# EAGLE design 8x8matrix (EAGLE 7.1.0)
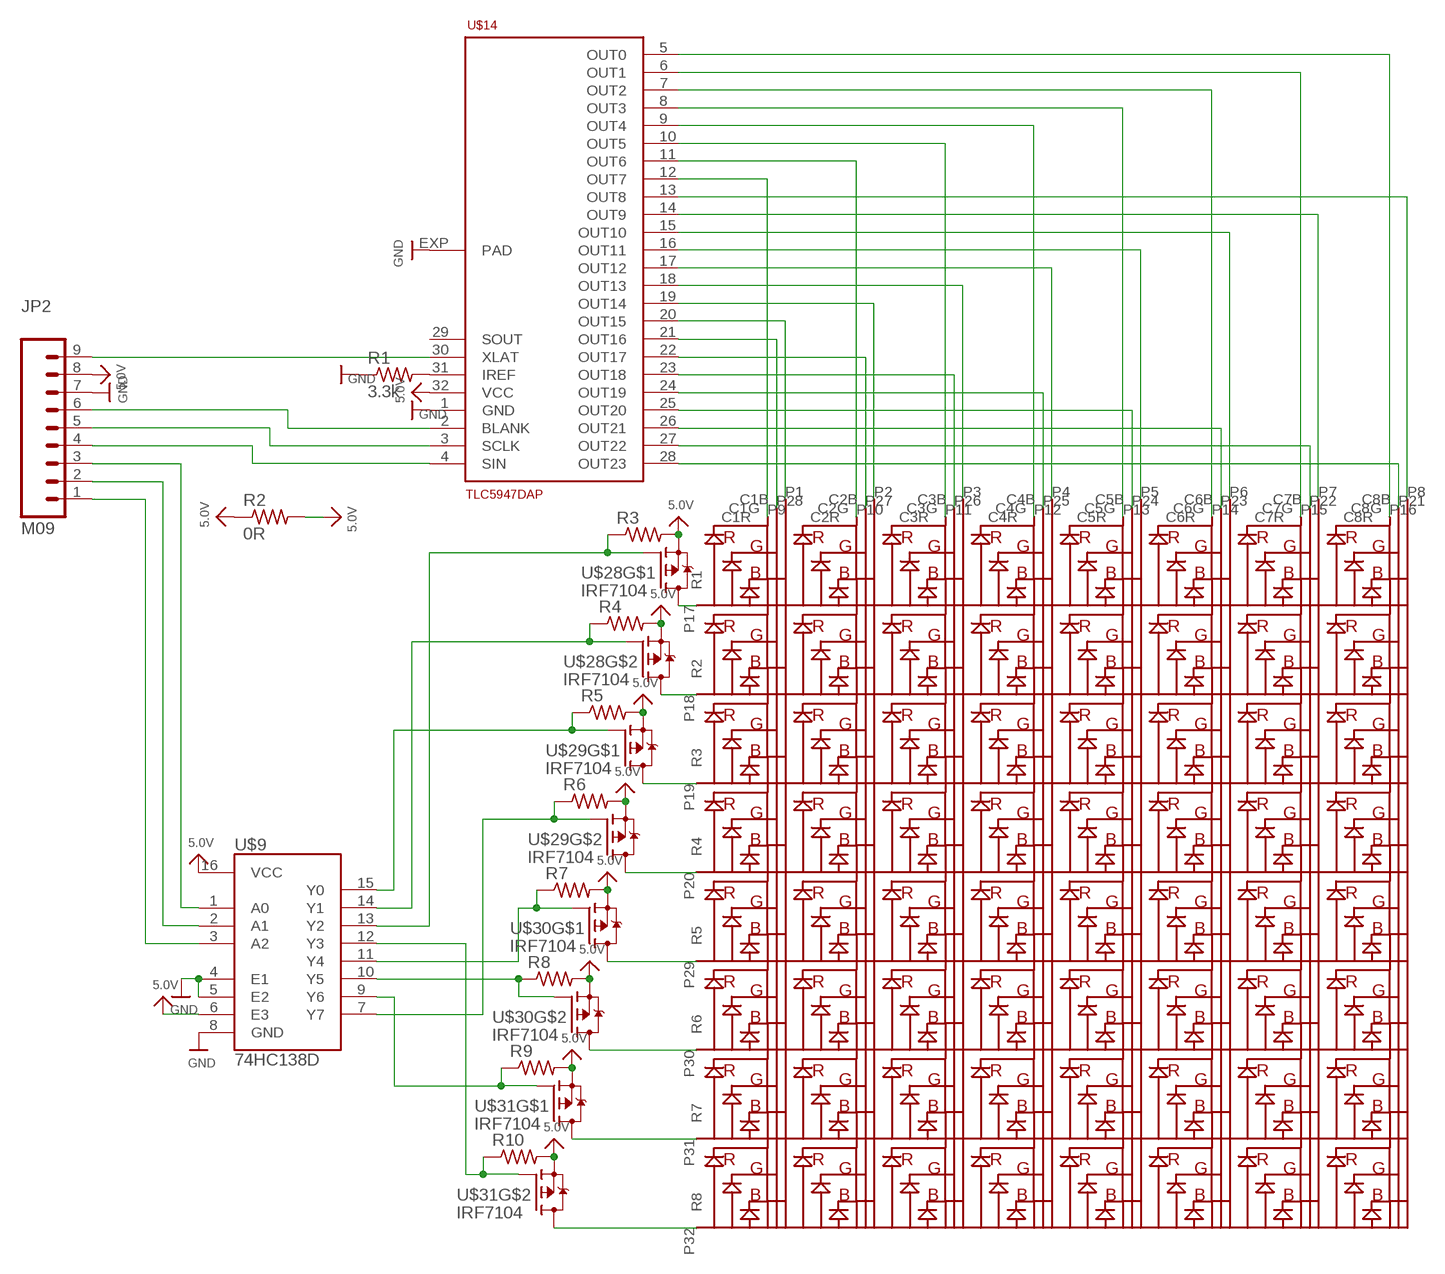
[diagram p0: schematic, sheet 1]

## Parts
JP2  M09  [1X09]
R1  3.3k  R-US_R0805  [R0805]
R2  0R  R-US_M1206  [M1206]
R3  R-US_R0805  [R0805]
R4  R-US_R0805  [R0805]
R5  R-US_R0805  [R0805]
R6  R-US_R0805  [R0805]
R7  R-US_R0805  [R0805]
R8  R-US_R0805  [R0805]
R9  R-US_R0805  [R0805]
R10  R-US_R0805  [R0805]
U$1  GTM2088ARGB  [8X8MATRIX]
U$9  74HC138D  [SO-16]
U$14  TLC5947DAP  [HTSSOP32DAP]
U$28  IRF7104  [SOIC8]
U$29  IRF7104  [SOIC8]
U$30  IRF7104  [SOIC8]
U$31  IRF7104  [SOIC8]

## Nets
5.0V: JP2.8 R2.1 R2.2 R3.2 R4.2 R5.2 R6.2 R7.2 R8.2 R9.2 R10.2 U$9.6(E3) U$9.16(VCC) U$14.32(VCC) U$28.1(S) U$28.3(S) U$29.1(S) U$29.3(S) U$30.1(S) U$30.3(S) U$31.1(S) U$31.3(S)
BLANK: JP2.6 U$14.2(BLANK)
GND: JP2.7 R1.1 U$9.4(E1) U$9.5(E2) U$9.8(GND) U$14.1(GND) U$14.EXP(PAD)
N$1: U$1.P16(C8R) U$14.5(OUT0)
N$2: U$1.P15(C7R) U$14.6(OUT1)
N$3: U$1.P14(C6R) U$14.7(OUT2)
N$4: U$1.P13(C5R) U$14.8(OUT3)
N$5: U$1.P12(C4R) U$14.9(OUT4)
N$6: U$1.P11(C3R) U$14.10(OUT5)
N$7: U$1.P10(C2R) U$14.11(OUT6)
N$8: U$1.P9(C1R) U$14.12(OUT7)
N$9: U$1.P8(C8B) U$14.13(OUT8)
N$10: U$1.P7(C7B) U$14.14(OUT9)
N$11: U$1.P6(C6B) U$14.15(OUT10)
N$12: U$1.P5(C5B) U$14.16(OUT11)
N$13: U$1.P4(C4B) U$14.17(OUT12)
N$14: U$1.P3(C3B) U$14.18(OUT13)
N$15: U$1.P2(C2B) U$14.19(OUT14)
N$16: U$1.P1(C1B) U$14.20(OUT15)
N$17: U$1.P28(C1G) U$14.21(OUT16)
N$18: U$1.P27(C2G) U$14.22(OUT17)
N$19: U$1.P26(C3G) U$14.23(OUT18)
N$20: U$1.P25(C4G) U$14.24(OUT19)
N$21: U$1.P24(C5G) U$14.25(OUT20)
N$22: U$1.P23(C6G) U$14.26(OUT21)
N$23: U$1.P22(C7G) U$14.27(OUT22)
N$24: U$1.P21(C8G) U$14.28(OUT23)
N$27: R1.2 U$14.31(IREF)
N$28: U$1.P19(R3) U$29.7(D) U$29.8(D)
N$32: U$1.P18(R2) U$28.5(D) U$28.6(D)
N$36: JP2.3 U$9.1(A0)
N$37: JP2.2 U$9.2(A1)
N$38: JP2.1 U$9.3(A2)
N$39: U$1.P17(R1) U$28.7(D) U$28.8(D)
N$40: U$1.P29(R5) U$30.7(D) U$30.8(D)
N$41: U$1.P31(R7) U$31.7(D) U$31.8(D)
N$42: U$1.P20(R4) U$29.5(D) U$29.6(D)
N$50: U$1.P30(R6) U$30.5(D) U$30.6(D)
N$52: U$1.P32(R8) U$31.5(D) U$31.6(D)
SCLK: JP2.5 U$14.3(SCLK)
SIN: JP2.4 U$14.4(SIN)
XLAT: JP2.9 U$14.30(XLAT)
Y0: R5.1 U$9.15(Y0) U$29.2(G)
Y1: R4.1 U$9.14(Y1) U$28.4(G)
Y2: R3.1 U$9.13(Y2) U$28.2(G)
Y3: R10.1 U$9.12(Y3) U$31.4(G)
Y4: R7.1 U$9.11(Y4) U$30.2(G)
Y5: R8.1 U$9.10(Y5) U$30.4(G)
Y6: R9.1 U$9.9(Y6) U$31.2(G)
Y7: R6.1 U$9.7(Y7) U$29.4(G)
Unconnected: U$14.29(SOUT)

## Library data of the parts
JP2 = SparkFun-Connectors:M09: Header 9 Standard 9-pin 0.1" header. Use with straight break away headers (SKU : PRT-00116), right angle break away headers (PRT-00553), swiss pins (PRT-00743), machine pins (PRT-00117), and female headers (PRT-00115).
R1-R10 = resistor:R-US_: RESISTOR, American symbol
U$1 = mylib:GTM2088ARGB: a 8x8 RGB matrix
U$9 = mylib:74HC138: M74HC238 - CMOS 3 TO 8 LINE DECODER
U$14 = TLC5947:TLC5947
U$28-U$31 = mylib:IRF7104

## Board
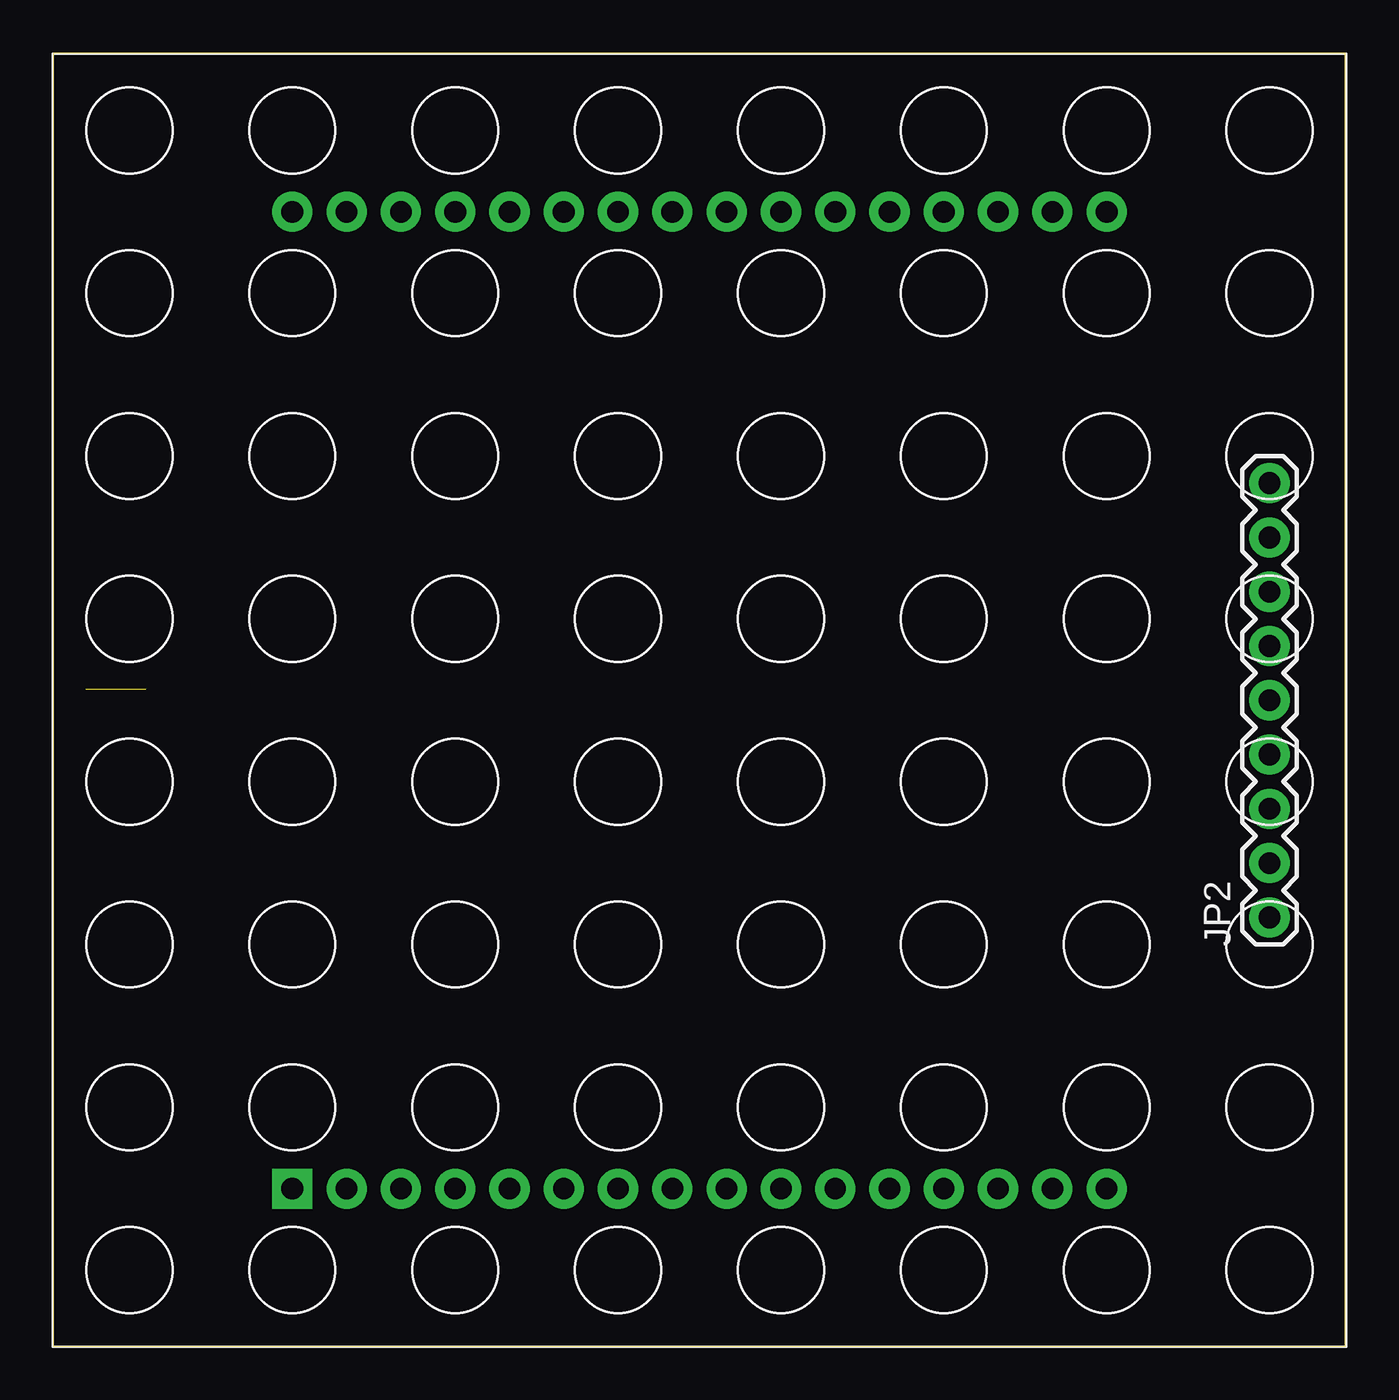
[diagram p1: board, top side]
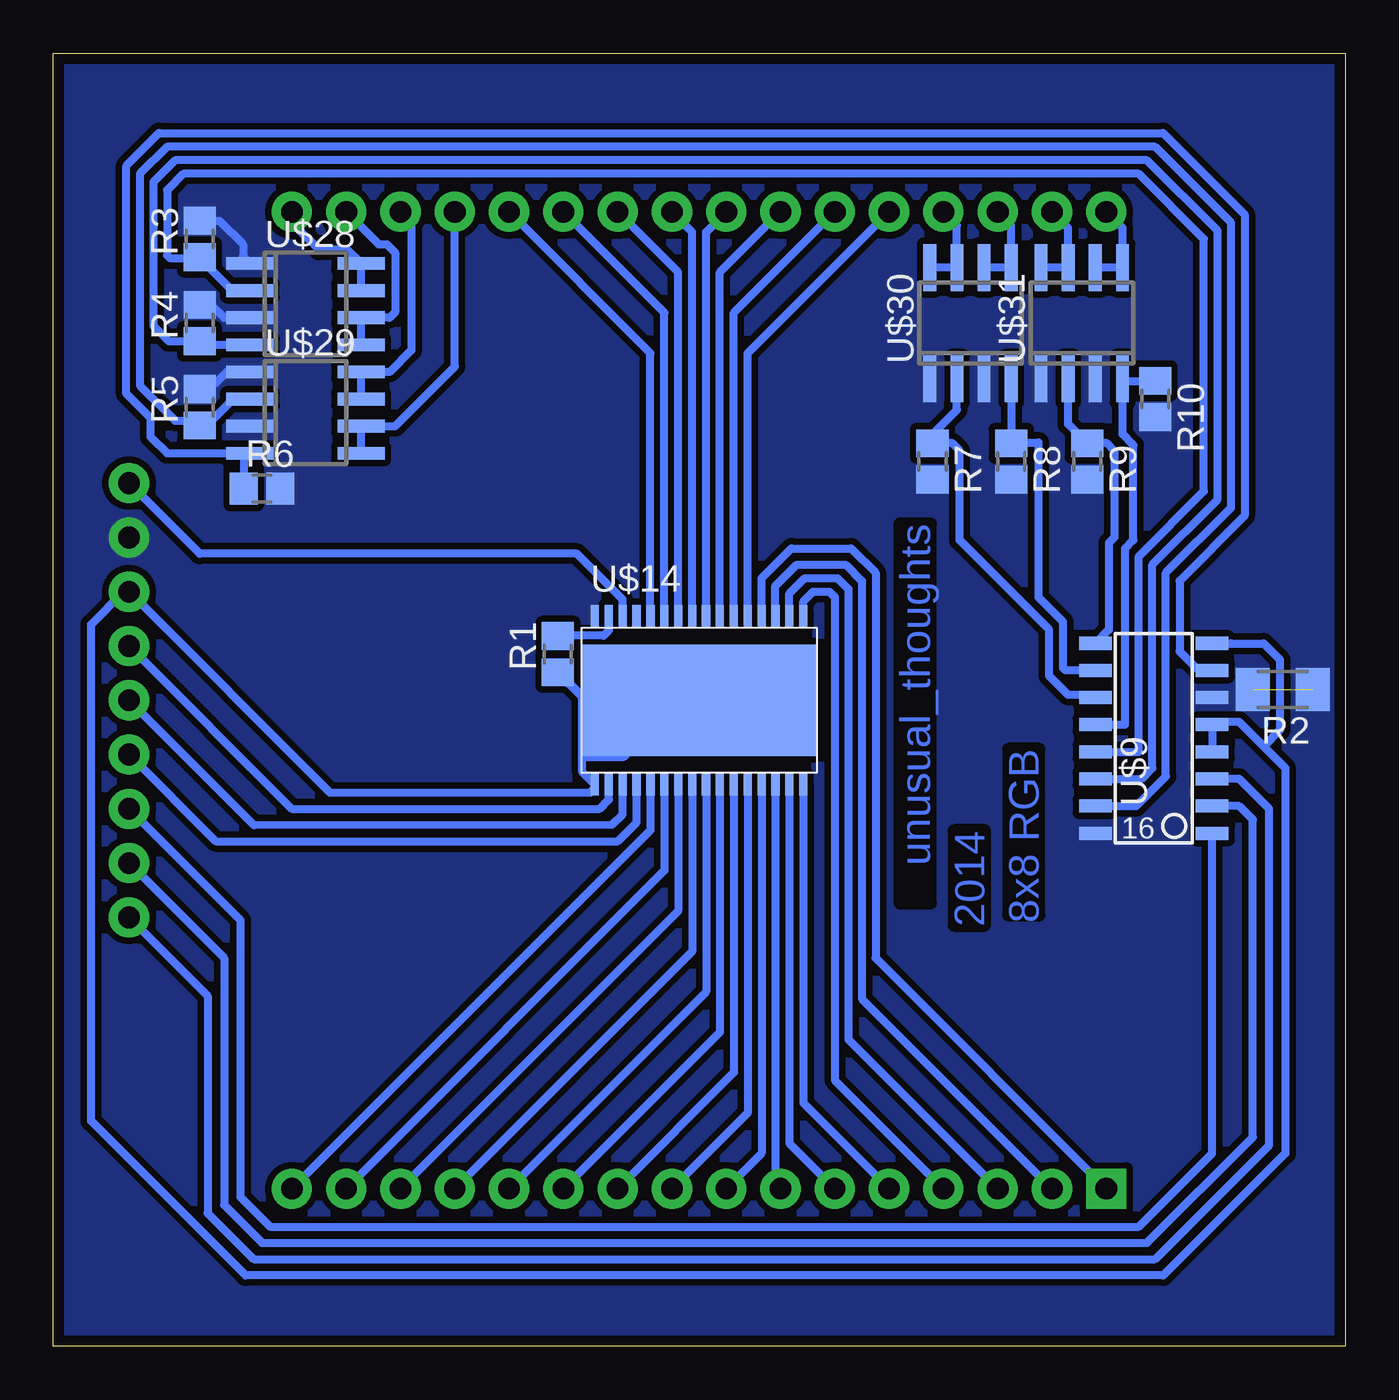
[diagram p2: board, bottom side, seen from below]

Size 60.43 x 60.5 mm. Coordinates in mm from the lower left corner, seen from the top.
Outline: 0,0 60.43,0 60.43,60.5 0,60.5 0,0
Copper layers (1*16): Top 0.035mm / dielectric 1.5mm / Bottom 0.035mm
Design rules "default *": minimum track width 15mil, minimum drill 24mil, track to track 10mil, track to pad 10mil, pad to pad 10mil, via to via 8mil, smd to smd 8mil, copper to edge 20mil, drill to drill 8mil, minimum pad ring 10mil, minimum via ring 8mil, stop-mask expansion 6mil, vias tented up to drill 0mil, thermal gap 10mil

### Footprints (pad centres in the part's own frame; a part is rotated, then mirrored left to right if it is on the bottom)
1X09 = drill 1.016 pad 1.88: 1 0,0; 2 2.54,0; 3 5.08,0; 4 7.62,0; 5 10.16,0; 6 12.7,0; 7 15.24,0; 8 17.78,0; 9 20.32,0
R0805 = smd 1.3 x 1.5: 1 -0.85,0; 2 0.85,0
M1206 = smd 1.6 x 2: 1 -1.4,0; 2 1.4,0
8X8MATRIX = drill 1.016 pad 1.88 square: P1 -19.05,-22.86 | drill 1.016 pad 1.88: P2 -16.51,-22.86; P3 -13.97,-22.86; P17 19.05,22.86; P18 16.51,22.86; P19 13.97,22.86; P20 11.43,22.86; P21 8.89,22.86; P22 6.35,22.86; P23 3.81,22.86; P24 1.27,22.86; P25 -1.27,22.86; P26 -3.81,22.86; P27 -6.35,22.86; P28 -8.89,22.86; P29 -11.43,22.86; P30 -13.97,22.86; P31 -16.51,22.86; P32 -19.05,22.86 | drill 1 pad 1.88: P4 -11.43,-22.86; P5 -8.89,-22.86; P6 -6.35,-22.86; P7 -3.81,-22.86; P8 -1.27,-22.86; P9 1.27,-22.86; P10 3.81,-22.86; P11 6.35,-22.86; P12 8.89,-22.86; P13 11.43,-22.86; P14 13.97,-22.86; P15 16.51,-22.86; P16 19.05,-22.86
SO-16 = smd 0.61 x 1.524: 1 -4.445,-2.794; 2 -3.175,-2.794; 3 -1.905,-2.794; 4 -0.635,-2.794; 5 0.635,-2.794; 6 1.905,-2.794; 7 3.175,-2.794; 8 4.445,-2.794; 9 4.445,2.667; 10 3.175,2.667; 11 1.905,2.667; 12 0.635,2.667; 13 -0.635,2.667; 14 -1.905,2.667; 15 -3.175,2.667; 16 -4.445,2.667
HTSSOP32DAP = smd 0.381 x 1: 1 -4.875,-3.95; 2 -4.225,-3.95; 3 -3.575,-3.95; 4 -2.925,-3.95; 5 -2.275,-3.95; 6 -1.625,-3.95; 7 -0.975,-3.95; 8 -0.325,-3.95; 9 0.325,-3.95; 10 0.975,-3.95; 11 1.625,-3.95; 12 2.275,-3.95; 13 2.925,-3.95; 14 3.575,-3.95; 15 4.225,-3.95; 16 4.875,-3.95; 17 4.875,3.95; 18 4.225,3.95; 19 3.575,3.95; 20 2.925,3.95; 21 2.275,3.95; 22 1.625,3.95; 23 0.975,3.95; 24 0.325,3.95; 25 -0.325,3.95; 26 -0.975,3.95; 27 -1.625,3.95; 28 -2.275,3.95; 29 -2.925,3.95; 30 -3.575,3.95; 31 -4.225,3.95; 32 -4.875,3.95 | smd 11 x 5.2: EXP 0,0
SOIC8 = smd 0.6 x 2.2: 1 -1.905,-2.6; 2 -0.635,-2.6; 3 0.635,-2.6; 4 1.905,-2.6; 5 1.905,2.6; 6 0.635,2.6; 7 -0.635,2.6; 8 -1.905,2.6

### Placement (x,y rotation side)
JP2  56.9,20.07 90 top
R1  36.83,32.38 90 bottom
R2  2.92,30.73 180 bottom
R3  53.59,51.82 90 bottom
R4  53.59,47.88 90 bottom
R5  53.59,43.94 90 bottom
R6  50.67,40.13 0 bottom
R7  19.3,41.4 270 bottom
R8  15.62,41.4 270 bottom
R9  12.06,41.4 270 bottom
R10  8.89,44.32 270 bottom
U$1  30.23,30.23 0 top
U$9  9.02,28.45 90 bottom
U$14  30.23,30.23 0 bottom
U$28  48.64,48.77 270 bottom
U$29  48.64,43.69 270 bottom
U$30  17.53,47.88 0 bottom
U$31  12.32,47.88 0 bottom

### Tracks (layer width: path | path; a pad name or v marks a point on that pad's centre or on a via)
5.0V  (1 unrouted)
  Bottom 0.381: R5.2 52.87,45.05 52.32,45.59 U$29.1 | R4.2 53.05,48.73 52.45,48.13 U$28.3 | R3.2 52.67,52.67 51.56,51.56 51.56,50.99 U$28.1
  pour Bottom (isolate 0.305, no thermals): 0,60.45 0,0 60.45,0 60.45,60.45
BLANK
  Bottom 0.381: U$14.2 34.44,26.22 34.44,25.58 34.87,25.15 49.28,25.15 JP2.6
GND
  Bottom 0.381: U$14.EXP 30.35,30.1 31.24,30.1 33.78,27.56 35.69,27.56 35.69,26.86 U$14.1 35.1,26.11 35.31,25.91 47.5,25.91 JP2.7 57.15,35.31 58.67,33.78 58.67,10.54 51.44,3.3 8.51,3.3 2.79,9.02 2.79,27.05 3.81,28.07 | U$9.4 U$9.5 6.1,29.21 4.95,29.21 3.81,28.07 | 5.33,32.89 U$9.8 3.81,32.89 3.05,32.13 3.05,28.83 3.81,28.07
  Bottom 0.406: 35.69,27.56 35.69,30.39 R1.1
N$1
  Bottom 0.381: U$14.5 32.5,24.14 U$1.P16
N$2
  Bottom 0.381: U$14.6 31.85,22.25 U$1.P15
N$3
  Bottom 0.381: U$14.7 31.2,20.36 U$1.P14
N$4
  Bottom 0.381: U$14.8 30.55,18.47 U$1.P13
N$5
  Bottom 0.381: U$14.9 29.9,16.58 U$1.P12
N$6
  Bottom 0.381: U$14.10 29.25,14.69 U$1.P11
N$7
  Bottom 0.381: U$14.11 28.6,12.8 U$1.P10
N$8
  Bottom 0.381: U$14.12 27.95,10.91 U$1.P9
N$9
  Bottom 0.381: U$14.13 27.3,9.02 U$1.P8
N$10
  Bottom 0.381: U$14.14 26.65,7.6 U$1.P7
N$11
  Bottom 0.381: U$14.15 26,9.49 U$1.P6
N$12
  Bottom 0.381: U$14.16 25.35,11.38 U$1.P5
N$13
  Bottom 0.381: U$14.17 25.35,34.85 24.89,35.31 24.13,35.31 23.88,35.05 23.88,12.45 U$1.P4
N$14
  Bottom 0.381: U$14.18 26,35.21 25.27,35.94 23.75,35.94 23.24,35.43 23.24,14.35 U$1.P3
N$15
  Bottom 0.381: U$14.19 26.65,35.58 25.65,36.58 23.37,36.58 22.61,35.81 22.61,16.26 U$1.P2
N$16
  Bottom 0.381: U$14.20 27.3,35.95 25.91,37.34 23.11,37.34 21.97,36.2 21.97,18.16 U$1.P1
N$17
  Bottom 0.381: U$14.21 27.95,46.47 U$1.P28
N$18
  Bottom 0.381: U$14.22 28.6,48.36 U$1.P27
N$19
  Bottom 0.381: U$14.23 29.25,50.25 U$1.P26
N$20
  Bottom 0.381: U$14.24 29.9,52.14 U$1.P25
N$21
  Bottom 0.381: U$14.25 30.55,52.14 U$1.P24
N$22
  Bottom 0.381: U$14.26 31.2,50.25 U$1.P23
N$23
  Bottom 0.381: U$14.27 31.85,48.36 U$1.P22
N$24
  Bottom 0.381: U$14.28 32.5,46.47 U$1.P21
N$27
  Bottom 0.381: U$14.31 34.45,33.49 34.7,33.25 36.82,33.25 R1.2
N$28
  Bottom 0.381: U$29.7 U$29.8 44.7,45.59 43.69,46.61 43.69,52.58 U$1.P19
N$32
  Bottom 0.381: U$28.5 U$28.6 44.7,48.13 44.45,48.39 44.45,51.18 44.83,51.56 45.21,51.56 U$1.P18
N$36
  Bottom 0.381: JP2.3 51.69,19.94 51.69,6.99 50.29,5.59 9.65,5.59 6.22,9.02 U$9.1
N$37
  Bottom 0.381: JP2.2 52.45,18.16 52.45,6.6 50.67,4.83 9.27,4.83 4.32,9.78 4.32,24.64 4.95,25.27 U$9.2
N$38
  Bottom 0.381: JP2.1 53.21,16.38 53.21,6.22 51.05,4.06 8.89,4.06 3.56,9.4 3.56,25.15 4.95,26.54 U$9.3
N$39
  Bottom 0.381: U$28.7 U$28.8 46.68,51.31 48.01,51.31 49.28,52.58 U$1.P17
N$40
  Bottom 0.381: U$1.P29 18.16,52.45 U$30.7 U$30.8
N$41
  Bottom 0.381: U$1.P31 12.95,52.32 U$31.7 U$31.8
N$42
  Bottom 0.381: U$29.5 U$29.6 45.97,43.12 45.97,43.18 45.85,43.05 44.45,43.05 41.66,45.85 U$1.P20
N$50
  Bottom 0.381: U$1.P30 15.62,52.45 U$30.5 U$30.6
N$52
  Bottom 0.381: U$1.P32 10.41,52.32 U$31.5 U$31.6
SCLK
  Bottom 0.381: U$14.3 33.81,26.26 33.81,24.89 34.29,24.41 51.05,24.38 JP2.5
SIN
  Bottom 0.381: U$14.4 33.15,24.51 34.04,23.62 52.83,23.62 JP2.4
XLAT
  Bottom 0.381: U$14.30 33.8,34.94 35.94,37.08 53.59,37.08 JP2.9
Y0
  Bottom 0.381: U$9.15 9.78,25.27 8.38,26.67 8.38,36.2 5.33,39.24 5.33,52.58 8.89,56.13 55.12,56.13 56.39,54.86 56.39,44.96 54.74,43.31 53.63,43.31 R5.1 53.25,43.38 52.96,43.38 52.02,44.32 U$29.2
Y1
  Bottom 0.381: U$9.14 9.53,26.54 9.02,27.05 9.02,36.58 5.97,39.62 5.97,52.2 9.27,55.5 54.74,55.5 55.75,54.48 55.75,47.75 55.03,47.03 R4.1 53.43,46.86 U$28.4
Y2
  Bottom 0.381: U$9.13 9.65,27.81 9.65,36.96 6.6,40.01 6.6,51.82 9.65,54.86 54.36,54.86 55.12,54.1 55.12,51.05 54.99,50.93 53.59,50.93 | 53.59,50.93 52.07,49.4 U$28.2 | R3.1 53.59,50.93
Y3
  Bottom 0.381: U$9.12 10.29,29.08 10.29,37.34 9.91,37.72 9.91,42.16 10.41,42.67 U$31.4 | 10.29,45.28 U$31.4 | U$31.4 10.31,45.17 R10.1
Y4
  Bottom 0.381: U$9.11 11.81,30.48 12.95,30.48 13.84,31.37 13.84,33.53 18.03,37.72 18.03,41.91 18.38,42.25 R7.1 19.34,42.29 19.68,42.29 18.16,43.81 U$30.2
Y5
  Bottom 0.381: U$9.10 13.08,31.62 13.21,31.75 13.21,33.91 14.35,35.05 14.35,42.29 15.58,42.29 R8.1 U$30.4
Y6
  Bottom 0.381: U$31.2 12.95,43.14 R9.1 11.14,42.25 10.79,41.91 10.79,37.85 11.05,37.59 11.05,33.53 U$9.9
Y7
  Bottom 0.381: R6.1 51.52,41.5 U$29.4 55.12,41.78 55.88,42.55 55.88,43.43 57.02,44.58 57.02,55.24 55.5,56.77 8.51,56.77 4.7,52.96 4.7,38.86 7.75,35.81 7.75,32.51 6.86,31.62 U$9.7

### Text on the board
Bottom: unusual_thoughts | 8x8 RGB | 2014